# EAGLE design Interconnect_board_limit_switches_v1p7 (EAGLE 9.5.2)
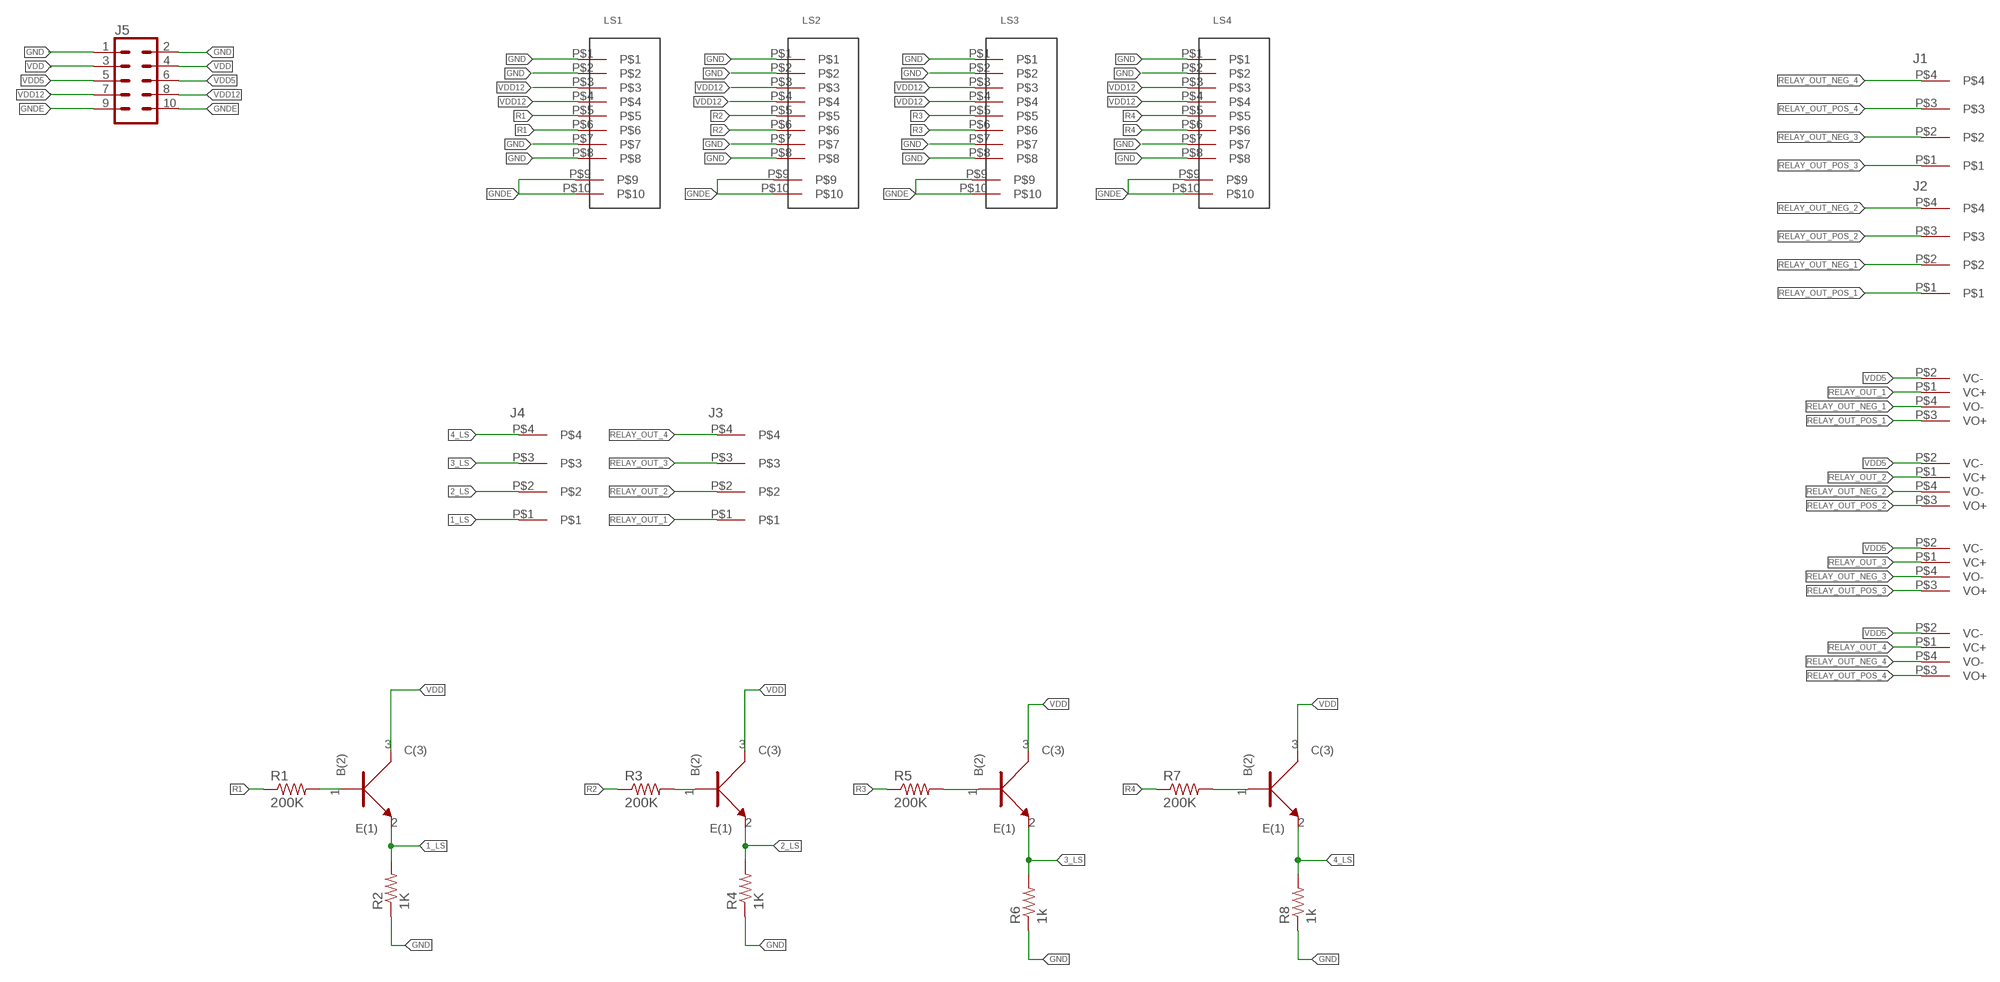
[diagram p0: schematic, sheet 1]

## Parts
J1  3.81MM_1_X_4_RT_ANGLE_PLUG_HEADER  [1X4_3.81MM_PITCH]
J2  3.81MM_1_X_4_RT_ANGLE_PLUG_HEADER  [1X4_3.81MM_PITCH]
J3  3.81MM_1_X_4_RT_ANGLE_PLUG_HEADER  [1X4_3.81MM_PITCH]
J4  3.81MM_1_X_4_RT_ANGLE_PLUG_HEADER  [1X4_3.81MM_PITCH]
J5  CONN_05X2PTH  [2X5]
LS1  RJ45_SMTRJ  [RJ45_SMT]
LS2  RJ45_SMTRJ  [RJ45_SMT]
LS3  RJ45_SMTRJ  [RJ45_SMT]
LS4  RJ45_SMTRJ  [RJ45_SMT]
R1  200K  R_0402  [0402]
R2  1K  R_0402  [0402]
R3  200K  R_0402  [0402]
R4  1K  R_0402  [0402]
R5  200K  R_0402  [0402]
R6  1k  R_0402  [0402]
R7  200K  R_0402  [0402]
R8  1k  R_0402  [0402]
RELAY_1  RELAY_KYOTO_KF0604D  [RELAY_KYOTO_KF0604D]
RELAY_2  RELAY_KYOTO_KF0604D  [RELAY_KYOTO_KF0604D]
RELAY_4  RELAY_KYOTO_KF0604D  [RELAY_KYOTO_KF0604D]
RELAY_5  RELAY_KYOTO_KF0604D  [RELAY_KYOTO_KF0604D]
U1  BC846BW  [SOT323]
U2  BC846BW  [SOT323]
U3  BC846BW  [SOT323]
U4  BC846BW  [SOT323]

## Nets
1_LS: J4.P$1 R2.P$2 U1.2(E(1))
2_LS: J4.P$2 R4.P$2 U2.2(E(1))
3_LS: J4.P$3 R6.P$2 U3.2(E(1))
4_LS: J4.P$4 R8.P$2 U4.2(E(1))
GND: J5.1 J5.2 LS1.P$1 LS1.P$2 LS1.P$7 LS1.P$8 LS2.P$1 LS2.P$2 LS2.P$7 LS2.P$8 LS3.P$1 LS3.P$2 LS3.P$7 LS3.P$8 LS4.P$1 LS4.P$2 LS4.P$7 LS4.P$8 R2.P$1 R4.P$1 R6.P$1 R8.P$1
GNDE: J5.9 J5.10 LS1.P$9 LS1.P$10 LS2.P$9 LS2.P$10 LS3.P$9 LS3.P$10 LS4.P$9 LS4.P$10
N$1: R1.P$2 U1.1(B(2))
N$2: R7.P$2 U4.1(B(2))
N$5: R3.P$2 U2.1(B(2))
N$11: R5.P$2 U3.1(B(2))
R1: LS1.P$5 LS1.P$6 R1.P$1
R2: LS2.P$5 LS2.P$6 R3.P$1
R3: LS3.P$5 LS3.P$6 R5.P$1
R4: LS4.P$5 LS4.P$6 R7.P$1
RELAY_OUT_1: J3.P$1 RELAY_1.P$1(VC+)
RELAY_OUT_2: J3.P$2 RELAY_2.P$1(VC+)
RELAY_OUT_3: J3.P$3 RELAY_5.P$1(VC+)
RELAY_OUT_4: J3.P$4 RELAY_4.P$1(VC+)
RELAY_OUT_NEG_1: J2.P$2 RELAY_1.P$4(VO-)
RELAY_OUT_NEG_2: J2.P$4 RELAY_2.P$4(VO-)
RELAY_OUT_NEG_3: J1.P$2 RELAY_5.P$4(VO-)
RELAY_OUT_NEG_4: J1.P$4 RELAY_4.P$4(VO-)
RELAY_OUT_POS_1: J2.P$1 RELAY_1.P$3(VO+)
RELAY_OUT_POS_2: J2.P$3 RELAY_2.P$3(VO+)
RELAY_OUT_POS_3: J1.P$1 RELAY_5.P$3(VO+)
RELAY_OUT_POS_4: J1.P$3 RELAY_4.P$3(VO+)
VDD: J5.3 J5.4 U1.3(C(3)) U2.3(C(3)) U3.3(C(3)) U4.3(C(3))
VDD5: J5.5 J5.6 RELAY_1.P$2(VC-) RELAY_2.P$2(VC-) RELAY_4.P$2(VC-) RELAY_5.P$2(VC-)
VDD12: J5.7 J5.8 LS1.P$3 LS1.P$4 LS2.P$3 LS2.P$4 LS3.P$3 LS3.P$4 LS4.P$3 LS4.P$4

## Library data of the parts
J1-J4 = 3D_MIG_Controller:3.81MM_1_X_4_RT_ANGLE_PLUG_HEADER
J5 = 3D_MIG_Controller:CONN_05X2: Multi connection point. Often used as Generic Header-pin footprint for 0.1 inch spaced/style header connections For AVR SPI programming port, see special device with nice symbol: "AVR_SPI_PROG_5x2.dev" You can populate with any combo of single row headers, but if you'd like an exact match, check these: 2x5 AVR ICSP Male Header <https://www.sparkfun.com/products/778> (PRT-00778) 2x5 Pin Shrouded Header <https://www.sparkfun.com/products/8506> (PRT-08506) On any of the 0.1 inch spaced packages, you can populate with these: Break Away Headers - Straight <https://www.sparkfun.com/products/116> (PRT-00116) Break Away Male Headers - Right Angle <https://www.sparkfun.com/products/553> (PRT-00553) Female Headers <https://www.sparkfun.com/products/115> (PRT-00115) Break Away Headers - Machine Pin <https://www.sparkfun.com/products/117> (PRT-00117) Break Away Female Headers - Swiss Machine Pin <https://www.sparkfun.com/products/743> (PRT-00743) Special note: the shrouded connector mates well with our 5x2 ribbon cables: 2x5 Pin IDC Ribbon Cable <https://www.sparkfun.com/products/8535> (PRT-08535); PROD_ID: CONN-08499; SF_ID: PRT-0778
LS1-LS4 = 3D_MIG_Controller:RJ45_SMT
R1-R8 = 3D_MIG_Controller:R_0402
RELAY_1 RELAY_2 RELAY_4 RELAY_5 = 3D_MIG_Controller:RELAY_KYOTO_KF0604D
U1-U4 = 3D_MIG_Controller:BC846BW; MANUFACTURER_PART_NUMBER: BC846BW; VENDOR: Nexperia

## Board
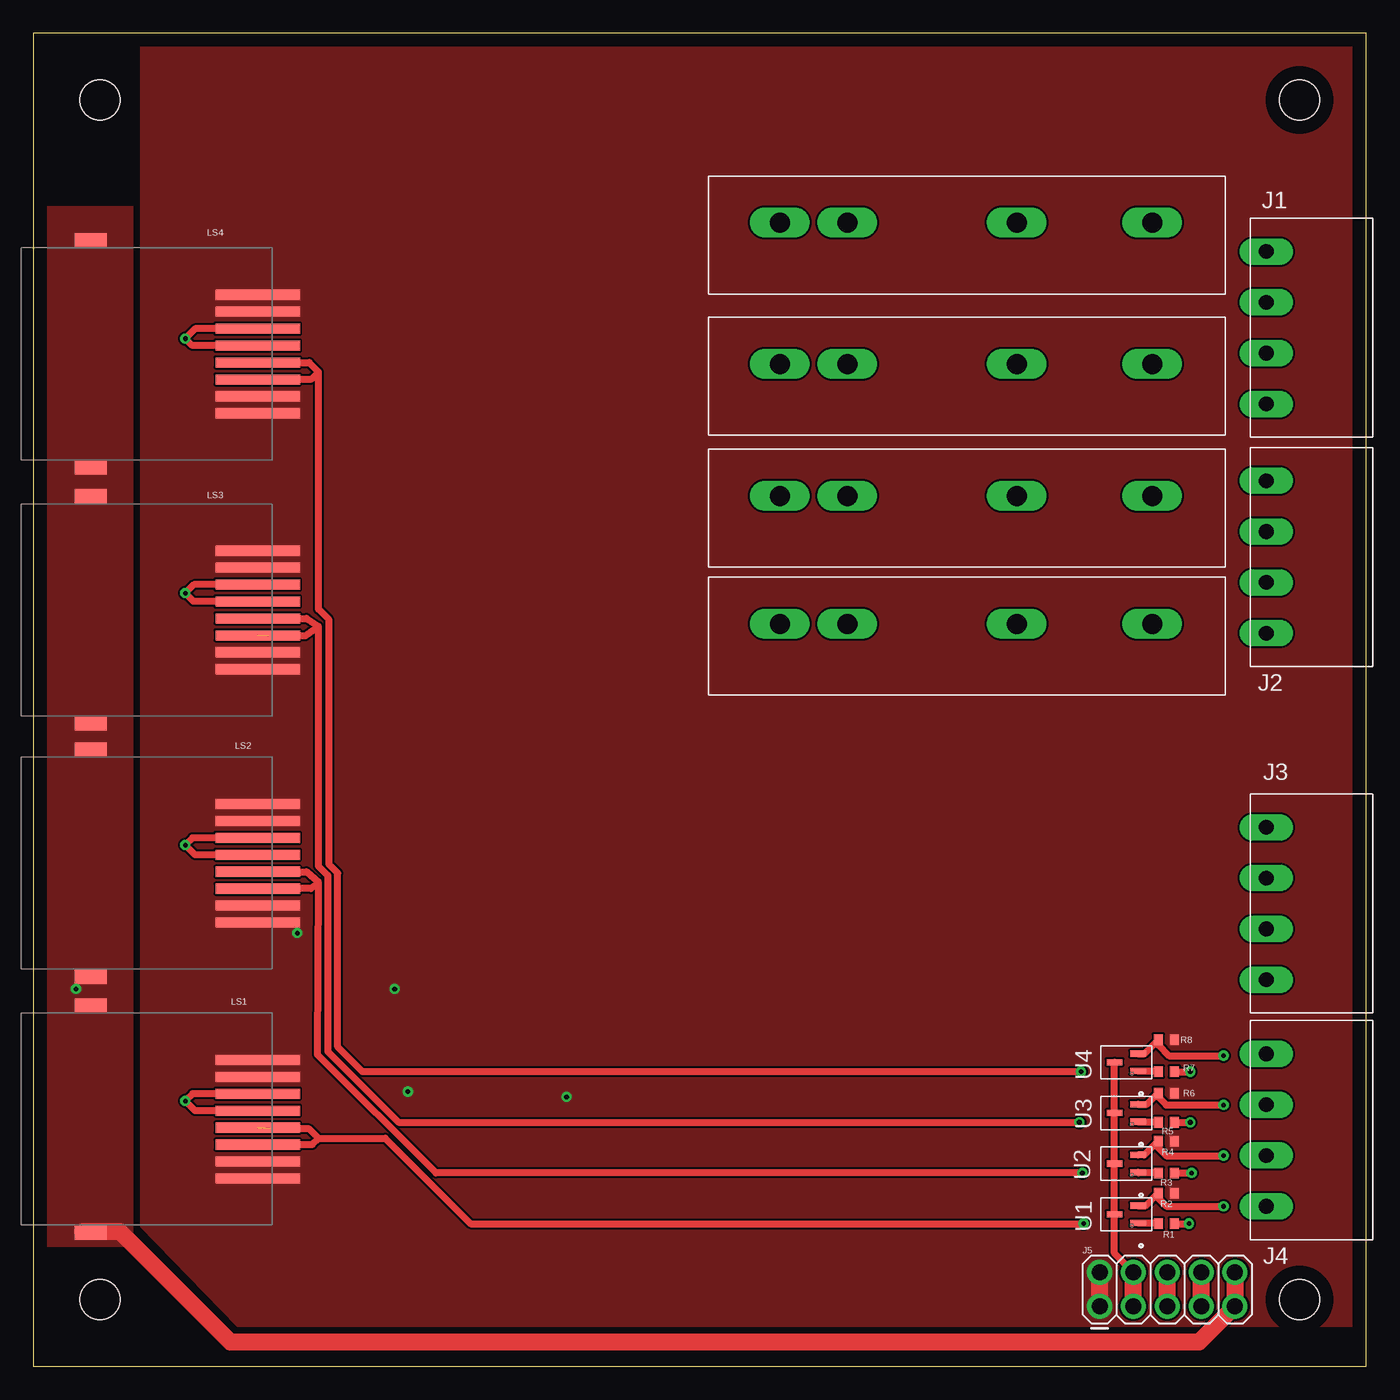
[diagram p1: board, top side]
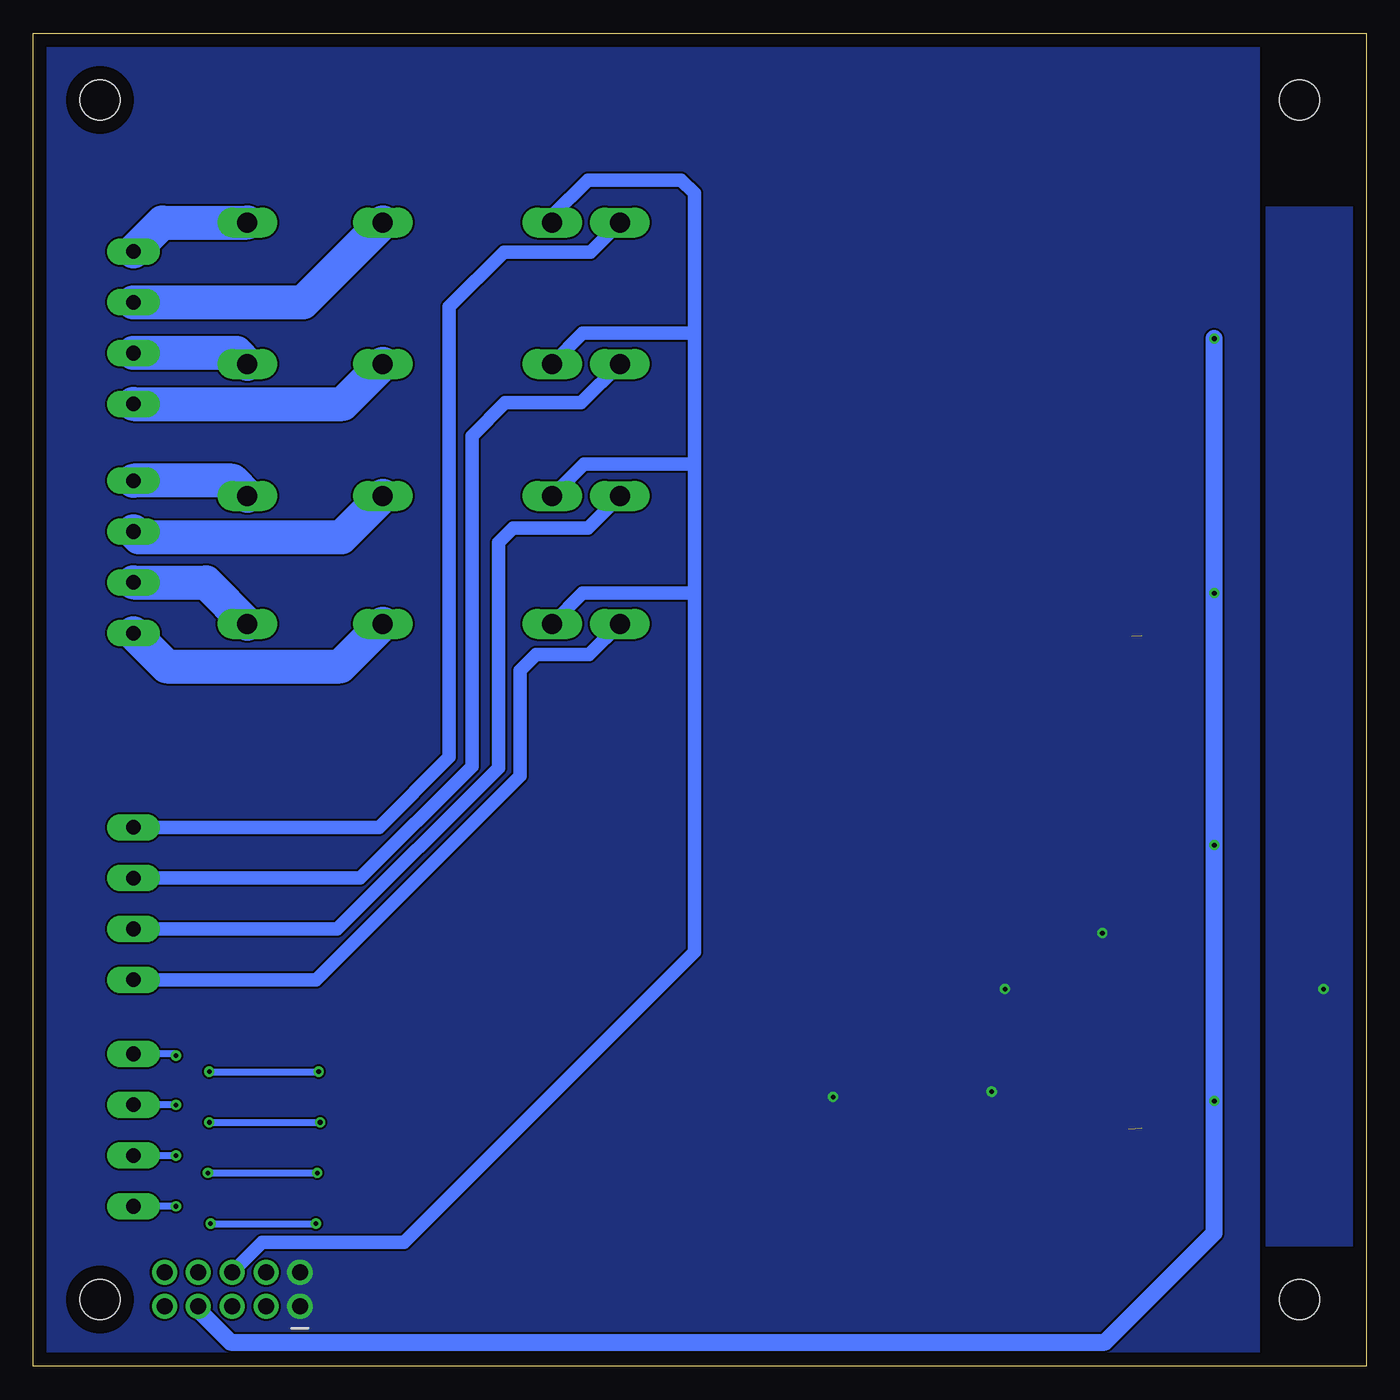
[diagram p2: board, bottom side, seen from below]

Size 100 x 100 mm. Coordinates in mm from the lower left corner, seen from the top.
Outline: 0,0 100,0 100,100 0,100 0,0
Copper layers (1*16): Top 0.035mm / dielectric 1.5mm / Bottom 0.035mm
Design rules "default": minimum track width 6mil, minimum drill 0.35mm, track to track 6mil, track to pad 6mil, pad to pad 6mil, via to via 6mil, smd to smd 6mil, copper to edge 40mil, drill to drill 6mil, minimum pad ring 10mil, minimum via ring 8mil, stop-mask expansion 4mil, vias tented up to drill 0mil, thermal gap 10mil
Holes 3 mm at 5,95 5,5 95,5 95,95

### Footprints (pad centres in the part's own frame; a part is rotated, then mirrored left to right if it is on the bottom)
1X4_3.81MM_PITCH = drill 1.1 pad 2 long: P$1 0,0; P$2 3.81,0; P$3 7.62,0; P$4 11.43,0
2X5 = drill 1.2 pad 1.88: 1 0,0; 2 0,2.54; 3 2.54,0; 4 2.54,2.54; 5 5.08,0; 6 5.08,2.54; 7 7.62,0; 8 7.62,2.54; 9 10.16,0; 10 10.16,2.54
RJ45_SMT = smd 0.76 x 6.35: P$1 -3.18,8.94; P$2 -1.91,8.94; P$3 -0.64,8.94; P$4 0.63,8.94; P$5 1.9,8.94; P$6 3.17,8.94; P$7 4.44,8.94; P$8 5.71,8.94 | smd 1.1 x 2.4: P$9 -7.25,-3.6; P$10 9.75,-3.6
0402 = smd 0.8 x 0.7: P$1 0,0.6; P$2 0,-0.6
RELAY_KYOTO_KF0604D = drill 1.5 long: P$1 0,0; P$2 -5.08,0; P$3 -17.78,0; P$4 -27.94,0
SOT323 = smd 0.457 x 1.168: 1 -0.65,-0.876; 2 0.65,-0.876; 3 0,0.876

### Placement (x,y rotation side)
J1  92.5,72.2 90 top
J2  92.5,55 90 top
J3  92.5,29 90 top
J4  92.5,12 90 top
J5  80,4.5 0 top
LS1  7.9,19.8 270 top
LS2  7.9,39 270 top
LS3  7.9,58 270 top
LS4  7.9,77.2 270 top
R1  85,10.7 270 top
R2  85,13 270 top
R3  85,14.5 270 top
R4  85,16.9 270 top
R5  85,18.3 270 top
R6  85,20.5 270 top
R7  85,22.1 270 top
R8  85,24.5 270 top
RELAY_1  56,55.7 180 top
RELAY_2  56,65.3 180 top
RELAY_4  56,85.8 180 top
RELAY_5  56,75.2 180 top
U1  82,11.4 90 top
U2  82,15.2 90 top
U3  82,19 90 top
U4  82,22.8 90 top

### Tracks (layer width: path | path; a pad name or v marks a point on that pad's centre or on a via)
1_LS  (via drill 0.35)
  Top 0.508: U1.2 83.45,12.05 R2.P$2 84.4,12.6 85,12 v89.3,12
  Bottom 0.508: v89.3,12 J4.P$1
2_LS  (via drill 0.35)
  Top 0.508: U2.2 83.35,15.85 R4.P$2 84.4,16.4 85,15.8 v89.3,15.8
  Bottom 0.508: v89.3,15.8 J4.P$2
3_LS  (via drill 0.35)
  Top 0.508: U3.2 83.55,19.65 R6.P$2 84.4,20.2 85,19.6 v89.3,19.6
  Bottom 0.508: v89.3,19.6 92.48,19.6 J4.P$3
4_LS  (via drill 0.35)
  Top 0.508: v89.3,23.3 85.2,23.3 84.4,24.1 R8.P$2 83.35,23.45 U4.2
  Bottom 0.508: v89.3,23.3 89.43,23.43 J4.P$4
GND  (via drill 0.35)
  Top 1.27: J5.1 J5.2
  other vias: 19.8,32.5 27.1,28.3 28.1,20.6 40,20.2
  pour Top (no thermals): 8,100 8,10.5 15.3,3 47.6,3 100,3 100,100
  pour Bottom (no thermals): 8,100 100,100 100,-0.4 8,-0.4
GNDE  (via drill 0.35)
  Top 1.27: J5.10 J5.9 87.46,1.8 14.8,1.8 6.5,10.1 3.7,10.1
  other vias: 3.2,28.3
  pour Top (no thermals): 7.5,87 0,87 0,9 7.5,9
  pour Bottom (no thermals): 7.5,87 0,87 0,9 7.5,9
N$1
  Top 0.508: U1.1 84.35,10.75 R1.P$2
N$2
  Top 0.508: U4.1 84.35,22.15 R7.P$2
N$5
  Top 0.508: R3.P$2 82.93,14.5 U2.1
N$11
  Top 0.508: U3.1 84.35,18.35 R5.P$2
R1  (via drill 0.35)  (1 unrouted)
  Top 0.508: 21.4,17.1 20.7,17.8 17.8,17.8 | LS1.P$6 20.93,16.63 21.4,17.1 | 21.4,17.1 26.4,17.1 32.8,10.7 v78.8,10.7 | R1.P$1 v86.7,10.7
  Bottom 0.508: v86.7,10.7 v78.8,10.7
R2  (via drill 0.35)
  Top 0.508: R3.P$1 v86.9,14.5 | 21.4,36.3 21.32,23.38 30.2,14.5 v78.7,14.5 | 21.4,36.3 20.83,35.83 LS2.P$6 | LS2.P$5 20.5,37.1 21.4,36.3
  Bottom 0.508: v86.9,14.5 v78.7,14.5
R3  (via drill 0.35)  (1 unrouted)
  Top 0.508: R5.P$1 v86.8,18.3 | 21.4,55.5 20.4,54.8 17.6,54.8 | 21.4,55.5 21.4,37.51 22.09,36.83 22.09,23.61 27.4,18.3 v78.48,18.3 | LS3.P$5 20.5,56.1 21.4,55.5
  Bottom 0.508: v86.8,18.3 v78.48,18.3
R4  (via drill 0.35)
  Top 0.508: R7.P$1 v86.8,22.1 | 21.4,74.6 21.4,56.8 22.18,56.02 22.18,37.66 22.84,37 22.84,23.95 24.7,22.1 v78.6,22.1 | 21.4,74.6 20.83,74.03 LS4.P$6 | LS4.P$5 20.7,75.3 21.4,74.6
  Bottom 0.508: v86.8,22.1 v78.6,22.1
RELAY_OUT_1
  Bottom 1.016: J3.P$1 78.8,29 63.5,44.3 63.5,52.2 62.3,53.4 58.3,53.4 RELAY_1.P$1
RELAY_OUT_2
  Bottom 1.016: J3.P$2 77.19,32.81 65.1,44.9 65.1,61.8 64,62.9 58.4,62.9 RELAY_2.P$1
RELAY_OUT_3
  Bottom 1.016: J3.P$3 75.48,36.62 67.1,45 67.1,69.8 64.6,72.3 58.9,72.3 RELAY_5.P$1
RELAY_OUT_4
  Bottom 1.016: J3.P$4 74.07,40.43 68.8,45.7 68.8,79.5 64.7,83.6 58.2,83.6 RELAY_4.P$1
RELAY_OUT_NEG_1
  Bottom 2.54: J2.P$2 87.05,58.81 RELAY_1.P$4
RELAY_OUT_NEG_2
  Bottom 2.54: RELAY_2.P$4 85.07,66.43 J2.P$4
RELAY_OUT_NEG_3
  Bottom 2.54: RELAY_5.P$4 84.75,76.01 J1.P$2
RELAY_OUT_NEG_4
  Bottom 2.54: J1.P$4 90.33,85.8 RELAY_4.P$4
RELAY_OUT_POS_1
  Bottom 2.54: J2.P$1 90,52.5 76.98,52.5 RELAY_1.P$3
RELAY_OUT_POS_2
  Bottom 2.54: J2.P$3 92.08,62.2 76.88,62.2 RELAY_2.P$3
RELAY_OUT_POS_3
  Bottom 2.54: J1.P$1 76.78,72.2 RELAY_5.P$3
RELAY_OUT_POS_4
  Bottom 2.54: J1.P$3 79.76,79.82 RELAY_4.P$3
VDD
  Top 0.508: J5.4 81.12,8.46 U1.3 U2.3 U3.3 U4.3
  Top 1.27: J5.3 J5.4
VDD5
  Top 1.27: J5.5 J5.6
  Bottom 1.016: J5.6 82.82,9.3 72.2,9.3 50.4,31.1 50.4,58 | 50.4,58 50.4,67.7 | 50.4,67.7 50.4,77.5 | 50.4,77.5 50.4,88 51.4,89 58.4,89 61.08,86.32 RELAY_4.P$2 | 50.4,77.5 58.78,77.5 RELAY_5.P$2 | RELAY_2.P$2 58.68,67.7 50.4,67.7 | RELAY_1.P$2 58.78,58 50.4,58
VDD12  (via drill 0.35)
  Top 0.508: 16.58,58.5 LS3.P$3 12.04,58.64 v11.4,58 12.03,57.37 LS3.P$4 | LS4.P$3 12.14,77.84 v11.4,77.1 11.93,76.57 LS4.P$4 | LS2.P$3 11.94,39.64 v11.4,39.1 12.13,38.37 LS2.P$4 | LS1.P$3 11.94,20.44 v11.4,19.9 12.13,19.17 LS1.P$4
  Top 1.27: J5.7 J5.8
  Bottom 1.27: J5.7 87.62,4.22 85.2,1.8 19.6,1.8 11.4,10 v11.4,19.9 v11.4,39.1 v11.4,58 v11.4,77.1